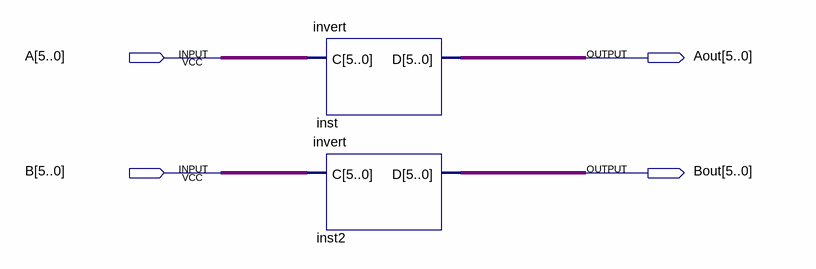
[diagram p0: schematic sheet]
// Quartus schematic invert2.bdf as structural Verilog: 2 symbols, 4 pins
module invert2 (
  input  [5:0] A,
  input  [5:0] B,
  output [5:0] Aout,
  output [5:0] Bout
);

  invert inst (.C(A), .D(Aout));
  invert inst2 (.C(B), .D(Bout));
endmodule
